# Altium project ZYNQ_Industrial_Data_Acquisition.PrjPcb (part 2 of 2)

## Sheet 10_FE_LANPORT.SchDoc
size A4; SheetNumber: 11; SheetTotal: 11
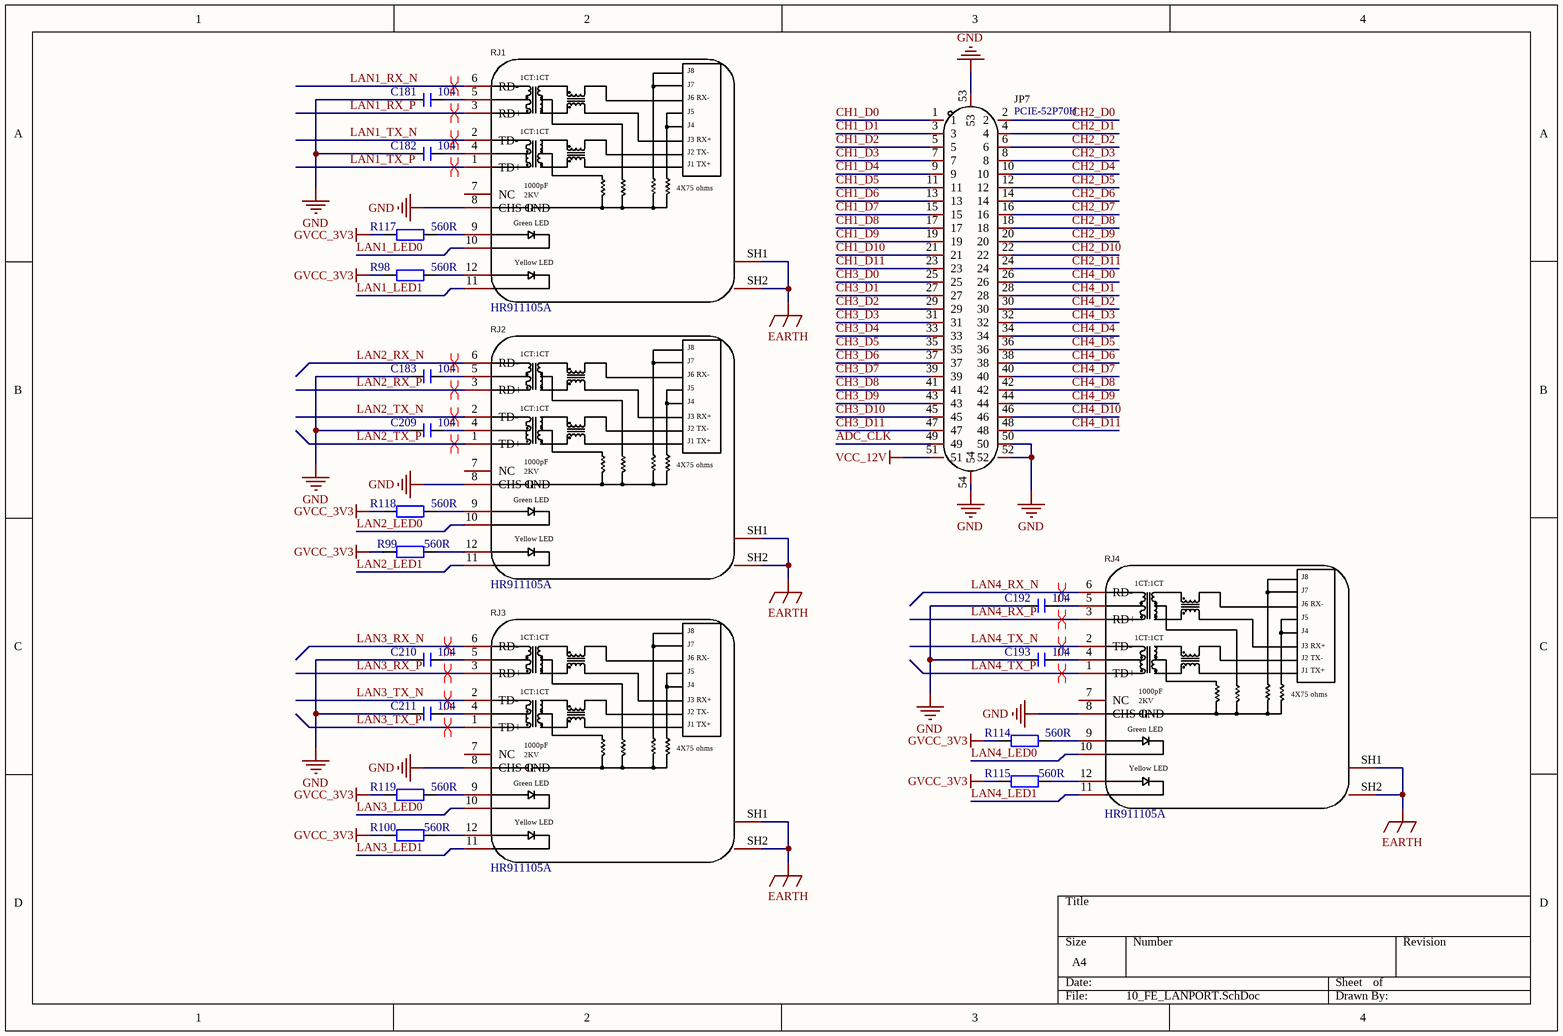
[diagram p9: 10_FE_LANPORT.SchDoc]

### Parts
C181  104  [C 0603]
C182  104  [C 0603]
C183  104  [C 0603]
C192  104  [C 0603]
C193  104  [C 0603]
C209  104  [C 0603]
C210  104  [C 0603]
C211  104  [C 0603]
JP7  PCIE-52P70H  [MINI PCIe]
R98  560R  [R 0603]
R99  560R  [R 0603]
R100  560R  [R 0603]
R114  560R  [R 0603]
R115  560R  [R 0603]
R117  560R  [R 0603]
R118  560R  [R 0603]
R119  560R  [R 0603]
RJ1  HR911105A  [HR91105A]
RJ2  HR911105A  [HR91105A]
RJ3  HR911105A  [HR91105A]
RJ4  HR911105A  [HR91105A]

### Nets
EARTH: RJ1.SH1 RJ1.SH2 RJ2.SH1 RJ2.SH2 RJ3.SH1 RJ3.SH2 RJ4.SH1 RJ4.SH2
GND: C181.1 C182.2 C183.2 C192.1 C193.1 C209.1 C210.1 C211.1 JP7.50 JP7.52 JP7.53 JP7.54 RJ1.8(CHS_GND) RJ2.8(CHS_GND) RJ3.8(CHS_GND) RJ4.8(CHS_GND)
GVCC_3V3: R98.2 R99.1 R100.1 R114.2 R115.1 R117.2 R118.2 R119.2
VCC_12V: JP7.51
ADC_CLK: JP7.49
CH1_D0: JP7.1
CH1_D1: JP7.3
CH1_D2: JP7.5
CH1_D3: JP7.7
CH1_D4: JP7.9
CH1_D5: JP7.11
CH1_D6: JP7.13
CH1_D7: JP7.15
CH1_D8: JP7.17
CH1_D9: JP7.19
CH1_D10: JP7.21
CH1_D11: JP7.23
CH2_D0: JP7.2
CH2_D1: JP7.4
CH2_D2: JP7.6
CH2_D3: JP7.8
CH2_D4: JP7.10
CH2_D5: JP7.12
CH2_D6: JP7.14
CH2_D7: JP7.16
CH2_D8: JP7.18
CH2_D9: JP7.20
CH2_D10: JP7.22
CH2_D11: JP7.24
CH3_D0: JP7.25
CH3_D1: JP7.27
CH3_D2: JP7.29
CH3_D3: JP7.31
CH3_D4: JP7.33
CH3_D5: JP7.35
CH3_D6: JP7.37
CH3_D7: JP7.39
CH3_D8: JP7.41
CH3_D9: JP7.43
CH3_D10: JP7.45
CH3_D11: JP7.47
CH4_D0: JP7.26
CH4_D1: JP7.28
CH4_D2: JP7.30
CH4_D3: JP7.32
CH4_D4: JP7.34
CH4_D5: JP7.36
CH4_D6: JP7.38
CH4_D7: JP7.40
CH4_D8: JP7.42
CH4_D9: JP7.44
CH4_D10: JP7.46
CH4_D11: JP7.48
LAN1_LED0: RJ1.10
LAN1_LED1: RJ1.11
LAN1_RX_N: RJ1.6(RD-)
LAN1_RX_P: RJ1.3(RD+)
LAN1_TX_N: RJ1.2(TD-)
LAN1_TX_P: RJ1.1(TD+)
LAN2_LED0: RJ2.10
LAN2_LED1: RJ2.11
LAN2_RX_N: RJ2.6(RD-)
LAN2_RX_P: RJ2.3(RD+)
LAN2_TX_N: RJ2.2(TD-)
LAN2_TX_P: RJ2.1(TD+)
LAN3_LED0: RJ3.10
LAN3_LED1: RJ3.11
LAN3_RX_N: RJ3.6(RD-)
LAN3_RX_P: RJ3.3(RD+)
LAN3_TX_N: RJ3.2(TD-)
LAN3_TX_P: RJ3.1(TD+)
LAN4_LED0: RJ4.10
LAN4_LED1: RJ4.11
LAN4_RX_N: RJ4.6(RD-)
LAN4_RX_P: RJ4.3(RD+)
LAN4_TX_N: RJ4.2(TD-)
LAN4_TX_P: RJ4.1(TD+)
NetC181_2: C181.2 RJ1.5
NetC182_1: C182.1 RJ1.4
NetC183_1: C183.1 RJ2.5
NetC192_2: C192.2 RJ4.5
NetC193_2: C193.2 RJ4.4
NetC209_2: C209.2 RJ2.4
NetC210_2: C210.2 RJ3.5
NetC211_2: C211.2 RJ3.4
NetR98_1: R98.1 RJ1.12
NetR99_2: R99.2 RJ2.12
NetR100_2: R100.2 RJ3.12
NetR114_1: R114.1 RJ4.9
NetR115_2: R115.2 RJ4.12
NetR117_1: R117.1 RJ1.9
NetR118_1: R118.1 RJ2.9
NetR119_1: R119.1 RJ3.9

Not connected (* = marked no-connect by the designer): RJ1 7(NC); RJ2 7(NC); RJ3 7(NC); RJ4 7(NC)

### Layout directives
differential pair: LAN1_RX_N, LAN1_RX_P, LAN1_TX_N, LAN1_TX_P, LAN2_RX_N, LAN2_RX_P, LAN2_TX_N, LAN2_TX_P, LAN3_RX_N, LAN3_RX_P, LAN3_TX_N, LAN3_TX_P, LAN4_RX_N, LAN4_RX_P, LAN4_TX_N, LAN4_TX_P

### Notes on the sheet
- (in symbol HR911105A) J8; 1CT:1CT; J7; J6 RX-; J5; J4; J3 RX+; J2 TX-; J1 TX+; 1000pF; 4X75 ohms; 2KV; Green LED; Yellow LED

### Library data of the parts
C181-C183 C192 C193 C209-C211 = C: 无极性贴片电容; 版权归属: 源创客; BOM名称: 无极性贴片电容; 学习资源: www.ooocke.com
JP7 = PCIE-52P70H: Manufacturer: XUNPU(讯普); Symbol: PCIE-52P70H_C2982554; Add into BOM: yes; Name: PCIE-52P70H; Device: PCIE-52P70H; LCSC Part Name: PCIE-52P70H; Supplier Part: C2982554; Manufacturer Part: PCIE-52P70H; Supplier Footprint: SMD,P=0.8mm; JLCPCB Part Class: Extended Part; Datasheet: https://atta.szlcsc.com/upload/public/pdf/source/20220311/DC8B167F9A8E29C645B8AA97E9059897.pdf; Supplier: LCSC; Convert to PCB: yes
R98-R100 R114 R115 R117-R119 = R: 贴片电阻; 版权归属: 源创客; BOM名称: 贴片电阻; 学习资源: www.ooocke.com
RJ1-RJ4 = HR911105A: Manufacturer: HANRUN(汉仁); Symbol: HR911105A_C12074; Add into BOM: yes; Connector Type: RJ插座; USOC Codes: RJ45; Number of Ports: 1; LED: 带LED; Name: HR911105A; Device: HR911105A_C12074; LCSC Part Name: RJ45 带LED 带LED灯; Supplier Part: C12074; Manufacturer Part: HR911105A; Supplier Footprint: 插件; JLCPCB Part Class: Extended Part; Datasheet: https://atta.szlcsc.com/upload/public/pdf/source/20170918/C12074_1505726819496976146.pdf; Supplier: LCSC; Convert to PCB: yes; Ratings: -; Shielding: -

## Nets that join several sheets
DDR_VREF: 01_DDR3L_256Mx32bits (8 pins), 02_ZYNQ_POWER (C38.2 C39.2 U1.H7 U1.P7), 03_SYS_POWER (C155.1 C156.1 U9.6), 09_TFCARD&USB2.0 (TP9.1)
DDR_VTT: 01_DDR3L_256Mx32bits (35 pins), 03_SYS_POWER (C151.1 C152.1 U9.3 U9.5), 09_TFCARD&USB2.0 (TP8.1)
EARTH: 03_SYS_POWER (JP2.1), 06_CAN&RS485 (13 pins), 08_HDMI (HDMI1.G1 HDMI1.G2 HDMI1.G3 HDMI1.G4), 10_FE_LANPORT (8 pins)
GND: 01_DDR3L_256Mx32bits (81 pins), 02_ZYNQ_POWER (129 pins), 03_SYS_POWER (63 pins), 04_ZYNQ_BANK13_33_34 (13 pins), 05_ZYNQ_BANK0_1_34_35 (14 pins), 06_CAN&RS485 (13 pins), 07_FE_SWITCHING (28 pins), 08_HDMI (17 pins), 09_TFCARD&USB2.0 (26 pins), 10_FE_LANPORT (16 pins)
GVCC_1V8: 03_SYS_POWER (C157.2 C158.2 U10.2), 07_FE_SWITCHING (7 pins), 09_TFCARD&USB2.0 (12 pins)
GVCC_3V3: 03_SYS_POWER (C139.2 C140.1 L8.2 R60.2), 04_ZYNQ_BANK13_33_34 (R84.1 R85.1), 05_ZYNQ_BANK0_1_34_35 (R121.1 R122.1 VD1.2), 06_CAN&RS485 (6 pins), 07_FE_SWITCHING (C200.2 L13.2 U16.3), 08_HDMI (C191.1 Q4.2), 09_TFCARD&USB2.0 (14 pins), 10_FE_LANPORT (8 pins)
VCC_1V0: 02_ZYNQ_POWER (30 pins), 03_SYS_POWER (5 pins), 09_TFCARD&USB2.0 (TP1.1)
VCC_1V8: 02_ZYNQ_POWER (23 pins), 03_SYS_POWER (7 pins), 04_ZYNQ_BANK13_33_34 (L3.1 U1.G9), 05_ZYNQ_BANK0_1_34_35 (R37.2 R108.1), 09_TFCARD&USB2.0 (TP4.1)
VCC_1V35: 01_DDR3L_256Mx32bits (61 pins), 02_ZYNQ_POWER (15 pins), 03_SYS_POWER (9 pins), 09_TFCARD&USB2.0 (TP3.1)
VCC_3V3: 02_ZYNQ_POWER (61 pins), 03_SYS_POWER (13 pins), 04_ZYNQ_BANK13_33_34 (9 pins), 05_ZYNQ_BANK0_1_34_35 (9 pins), 09_TFCARD&USB2.0 (TP5.1)
VCC_5V0: 03_SYS_POWER (28 pins), 06_CAN&RS485 (C162.2 C163.2 U11.8), 08_HDMI (D3.1 R124.2), 09_TFCARD&USB2.0 (5 pins)
VCC_12V: 03_SYS_POWER (5 pins), 10_FE_LANPORT (JP7.51)
ADC_CLK: 04_ZYNQ_BANK13_33_34 (U1.W18), 10_FE_LANPORT (JP7.49)
AXI_I2C1_SCL: 04_ZYNQ_BANK13_33_34 (U1.AB22), 05_ZYNQ_BANK0_1_34_35 (R121.2 U15.6)
AXI_I2C1_SDA: 04_ZYNQ_BANK13_33_34 (U1.AB21), 05_ZYNQ_BANK0_1_34_35 (R122.2 U15.5)
AXI_I2C2_SCL: 05_ZYNQ_BANK0_1_34_35 (U1.H22), 08_HDMI (Q1.2 R76.1)
AXI_I2C2_SDA: 05_ZYNQ_BANK0_1_34_35 (U1.J21), 08_HDMI (Q2.2 R80.1)
AXI_UART1_DE: 05_ZYNQ_BANK0_1_34_35 (U1.B20), 06_CAN&RS485 (U12.4 U12.5)
AXI_UART1_RX: 05_ZYNQ_BANK0_1_34_35 (U1.A21), 06_CAN&RS485 (U12.6)
AXI_UART1_TX: 05_ZYNQ_BANK0_1_34_35 (U1.B19), 06_CAN&RS485 (U12.3)
BOOT_MODE0: 01_DDR3L_256Mx32bits (U1.E4), 04_ZYNQ_BANK13_33_34 (R112.1)
BOOT_MODE1: 01_DDR3L_256Mx32bits (U1.A3), 04_ZYNQ_BANK13_33_34 (R111.1)
CAN0_RX: 01_DDR3L_256Mx32bits (U1.G7), 06_CAN&RS485 (U11.4)
CAN0_TX: 01_DDR3L_256Mx32bits (U1.B4), 06_CAN&RS485 (U11.5)
CH1_D0: 04_ZYNQ_BANK13_33_34 (U1.AA16), 10_FE_LANPORT (JP7.1)
CH1_D1: 04_ZYNQ_BANK13_33_34 (U1.AB17), 10_FE_LANPORT (JP7.3)
CH1_D2: 04_ZYNQ_BANK13_33_34 (U1.AA17), 10_FE_LANPORT (JP7.5)
CH1_D3: 04_ZYNQ_BANK13_33_34 (U1.AB19), 10_FE_LANPORT (JP7.7)
CH1_D4: 04_ZYNQ_BANK13_33_34 (U1.AA19), 10_FE_LANPORT (JP7.9)
CH1_D5: 04_ZYNQ_BANK13_33_34 (U1.Y19), 10_FE_LANPORT (JP7.11)
CH1_D6: 04_ZYNQ_BANK13_33_34 (U1.AB20), 10_FE_LANPORT (JP7.13)
CH1_D7: 04_ZYNQ_BANK13_33_34 (U1.Y20), 10_FE_LANPORT (JP7.15)
CH1_D8: 04_ZYNQ_BANK13_33_34 (U1.AA21), 10_FE_LANPORT (JP7.17)
CH1_D9: 04_ZYNQ_BANK13_33_34 (U1.Y21), 10_FE_LANPORT (JP7.19)
CH1_D10: 04_ZYNQ_BANK13_33_34 (U1.W20), 10_FE_LANPORT (JP7.21)
CH1_D11: 04_ZYNQ_BANK13_33_34 (U1.AA22), 10_FE_LANPORT (JP7.23)
CH2_D0: 04_ZYNQ_BANK13_33_34 (U1.V20), 10_FE_LANPORT (JP7.2)
CH2_D1: 04_ZYNQ_BANK13_33_34 (U1.W21), 10_FE_LANPORT (JP7.4)
CH2_D2: 04_ZYNQ_BANK13_33_34 (U1.W22), 10_FE_LANPORT (JP7.6)
CH2_D3: 04_ZYNQ_BANK13_33_34 (U1.U20), 10_FE_LANPORT (JP7.8)
CH2_D4: 05_ZYNQ_BANK0_1_34_35 (U1.T19), 10_FE_LANPORT (JP7.10)
CH2_D5: 04_ZYNQ_BANK13_33_34 (U1.U22), 10_FE_LANPORT (JP7.12)
CH2_D6: 04_ZYNQ_BANK13_33_34 (U1.T21), 10_FE_LANPORT (JP7.14)
CH2_D7: 05_ZYNQ_BANK0_1_34_35 (U1.R20), 10_FE_LANPORT (JP7.16)
CH2_D8: 05_ZYNQ_BANK0_1_34_35 (U1.R21), 10_FE_LANPORT (JP7.18)
CH2_D9: 05_ZYNQ_BANK0_1_34_35 (U1.P21), 10_FE_LANPORT (JP7.20)
CH2_D10: 05_ZYNQ_BANK0_1_34_35 (U1.P22), 10_FE_LANPORT (JP7.22)
CH2_D11: 05_ZYNQ_BANK0_1_34_35 (U1.P20), 10_FE_LANPORT (JP7.24)
CH3_D0: 04_ZYNQ_BANK13_33_34 (U1.AB10), 10_FE_LANPORT (JP7.25)
CH3_D1: 04_ZYNQ_BANK13_33_34 (U1.AA11), 10_FE_LANPORT (JP7.27)
CH3_D2: 04_ZYNQ_BANK13_33_34 (U1.AB11), 10_FE_LANPORT (JP7.29)
CH3_D3: 04_ZYNQ_BANK13_33_34 (U1.AA12), 10_FE_LANPORT (JP7.31)
CH3_D4: 04_ZYNQ_BANK13_33_34 (U1.AB12), 10_FE_LANPORT (JP7.33)
CH3_D5: 04_ZYNQ_BANK13_33_34 (U1.AB14), 10_FE_LANPORT (JP7.35)
CH3_D6: 04_ZYNQ_BANK13_33_34 (U1.Y14), 10_FE_LANPORT (JP7.37)
CH3_D7: 04_ZYNQ_BANK13_33_34 (U1.AA14), 10_FE_LANPORT (JP7.39)
CH3_D8: 04_ZYNQ_BANK13_33_34 (U1.Y18), 10_FE_LANPORT (JP7.41)
CH3_D9: 04_ZYNQ_BANK13_33_34 (U1.W16), 10_FE_LANPORT (JP7.43)
CH3_D10: 04_ZYNQ_BANK13_33_34 (U1.V18), 10_FE_LANPORT (JP7.45)
CH3_D11: 04_ZYNQ_BANK13_33_34 (U1.V22), 10_FE_LANPORT (JP7.47)
CH4_D0: 05_ZYNQ_BANK0_1_34_35 (U1.M20), 10_FE_LANPORT (JP7.26)
CH4_D1: 05_ZYNQ_BANK0_1_34_35 (U1.N22), 10_FE_LANPORT (JP7.28)
CH4_D2: 05_ZYNQ_BANK0_1_34_35 (U1.M22), 10_FE_LANPORT (JP7.30)
CH4_D3: 05_ZYNQ_BANK0_1_34_35 (U1.M21), 10_FE_LANPORT (JP7.32)
CH4_D4: 05_ZYNQ_BANK0_1_34_35 (U1.M19), 10_FE_LANPORT (JP7.34)
CH4_D5: 05_ZYNQ_BANK0_1_34_35 (U1.L22), 10_FE_LANPORT (JP7.36)
CH4_D6: 05_ZYNQ_BANK0_1_34_35 (U1.L19), 10_FE_LANPORT (JP7.38)
CH4_D7: 05_ZYNQ_BANK0_1_34_35 (U1.L21), 10_FE_LANPORT (JP7.40)
CH4_D8: 05_ZYNQ_BANK0_1_34_35 (U1.K20), 10_FE_LANPORT (JP7.42)
CH4_D9: 05_ZYNQ_BANK0_1_34_35 (U1.K21), 10_FE_LANPORT (JP7.44)
CH4_D10: 05_ZYNQ_BANK0_1_34_35 (U1.J18), 10_FE_LANPORT (JP7.46)
CH4_D11: 05_ZYNQ_BANK0_1_34_35 (U1.J20), 10_FE_LANPORT (JP7.48)
ETH0_RXCLK: 05_ZYNQ_BANK0_1_34_35 (U1.A14), 07_FE_SWITCHING (U5.44)
ETH0_RXCTL: 05_ZYNQ_BANK0_1_34_35 (U1.D7), 07_FE_SWITCHING (U5.51)
ETH0_RXD0: 05_ZYNQ_BANK0_1_34_35 (U1.E11), 07_FE_SWITCHING (U5.45)
ETH0_RXD1: 05_ZYNQ_BANK0_1_34_35 (U1.B7), 07_FE_SWITCHING (U5.46)
ETH0_RXD2: 05_ZYNQ_BANK0_1_34_35 (U1.F12), 07_FE_SWITCHING (U5.49)
ETH0_RXD3: 05_ZYNQ_BANK0_1_34_35 (U1.A13), 07_FE_SWITCHING (U5.50)
ETH0_TXCLK: 05_ZYNQ_BANK0_1_34_35 (U1.D6), 07_FE_SWITCHING (U5.43)
ETH0_TXCTL: 05_ZYNQ_BANK0_1_34_35 (U1.F11), 07_FE_SWITCHING (U5.29)
ETH0_TXD0: 05_ZYNQ_BANK0_1_34_35 (U1.E9), 07_FE_SWITCHING (U5.30)
ETH0_TXD1: 05_ZYNQ_BANK0_1_34_35 (U1.A7), 07_FE_SWITCHING (U5.32)
ETH0_TXD2: 05_ZYNQ_BANK0_1_34_35 (U1.E10), 07_FE_SWITCHING (U5.35)
ETH0_TXD3: 05_ZYNQ_BANK0_1_34_35 (U1.A8), 07_FE_SWITCHING (U5.36)
HDMI_CK_N: 05_ZYNQ_BANK0_1_34_35 (U1.G21), 08_HDMI (D2.5 D2.6 HDMI1.12 R73.1)
HDMI_CK_P: 05_ZYNQ_BANK0_1_34_35 (U1.G20), 08_HDMI (D2.4 D2.7 HDMI1.10 R72.1)
HDMI_D0_N: 05_ZYNQ_BANK0_1_34_35 (U1.D21), 08_HDMI (D2.2 D2.9 HDMI1.9 R71.1)
HDMI_D0_P: 05_ZYNQ_BANK0_1_34_35 (U1.E21), 08_HDMI (D2.1 D2.10 HDMI1.7 R70.1)
HDMI_D1_N: 05_ZYNQ_BANK0_1_34_35 (U1.B22), 08_HDMI (D1.5 D1.6 HDMI1.6 R69.1)
HDMI_D1_P: 05_ZYNQ_BANK0_1_34_35 (U1.B21), 08_HDMI (D1.4 D1.7 HDMI1.4 R68.1)
HDMI_D2_N: 05_ZYNQ_BANK0_1_34_35 (U1.A19), 08_HDMI (D1.2 D1.9 HDMI1.3 R67.1)
HDMI_D2_P: 05_ZYNQ_BANK0_1_34_35 (U1.A18), 08_HDMI (D1.1 D1.10 HDMI1.1 R66.1)
HDMI_HPD: 05_ZYNQ_BANK0_1_34_35 (U1.J22), 08_HDMI (R90.1 R91.2)
LAN1_LED0: 07_FE_SWITCHING (U5.65), 10_FE_LANPORT (RJ1.10)
LAN1_LED1: 07_FE_SWITCHING (U5.64), 10_FE_LANPORT (RJ1.11)
LAN1_RX_N: 07_FE_SWITCHING (U5.5), 10_FE_LANPORT (RJ1.6)
LAN1_RX_P: 07_FE_SWITCHING (U5.4), 10_FE_LANPORT (RJ1.3)
LAN1_TX_N: 07_FE_SWITCHING (U5.7), 10_FE_LANPORT (RJ1.2)
LAN1_TX_P: 07_FE_SWITCHING (U5.6), 10_FE_LANPORT (RJ1.1)
LAN2_LED0: 07_FE_SWITCHING (R116.2 U5.63), 10_FE_LANPORT (RJ2.10)
LAN2_LED1: 07_FE_SWITCHING (U5.62), 10_FE_LANPORT (RJ2.11)
LAN2_RX_N: 07_FE_SWITCHING (U5.9), 10_FE_LANPORT (RJ2.6)
LAN2_RX_P: 07_FE_SWITCHING (U5.8), 10_FE_LANPORT (RJ2.3)
LAN2_TX_N: 07_FE_SWITCHING (U5.11), 10_FE_LANPORT (RJ2.2)
LAN2_TX_P: 07_FE_SWITCHING (U5.10), 10_FE_LANPORT (RJ2.1)
LAN3_LED0: 07_FE_SWITCHING (U5.25), 10_FE_LANPORT (RJ3.10)
LAN3_LED1: 07_FE_SWITCHING (U5.24), 10_FE_LANPORT (RJ3.11)
LAN3_RX_N: 07_FE_SWITCHING (U5.14), 10_FE_LANPORT (RJ3.6)
LAN3_RX_P: 07_FE_SWITCHING (U5.13), 10_FE_LANPORT (RJ3.3)
LAN3_TX_N: 07_FE_SWITCHING (U5.16), 10_FE_LANPORT (RJ3.2)
LAN3_TX_P: 07_FE_SWITCHING (U5.15), 10_FE_LANPORT (RJ3.1)
LAN4_LED0: 07_FE_SWITCHING (U5.31), 10_FE_LANPORT (RJ4.10)
LAN4_LED1: 07_FE_SWITCHING (U5.28), 10_FE_LANPORT (RJ4.11)
LAN4_RX_N: 07_FE_SWITCHING (U5.18), 10_FE_LANPORT (RJ4.6)
LAN4_RX_P: 07_FE_SWITCHING (U5.17), 10_FE_LANPORT (RJ4.3)
LAN4_TX_N: 07_FE_SWITCHING (U5.20), 10_FE_LANPORT (RJ4.2)
LAN4_TX_P: 07_FE_SWITCHING (U5.19), 10_FE_LANPORT (RJ4.1)
PL_CLK: 04_ZYNQ_BANK13_33_34 (U1.U21), 05_ZYNQ_BANK0_1_34_35 (R81.2)
PS_LED: 01_DDR3L_256Mx32bits (U1.A1), 04_ZYNQ_BANK13_33_34 (D12.2)
PS_MIO2: 01_DDR3L_256Mx32bits (U1.A2), 04_ZYNQ_BANK13_33_34 (R34.2)
PS_MIO3: 01_DDR3L_256Mx32bits (U1.F6), 04_ZYNQ_BANK13_33_34 (R51.2)
PS_MIO6: 01_DDR3L_256Mx32bits (U1.A4), 04_ZYNQ_BANK13_33_34 (R31.2)
PS_MIO7: 01_DDR3L_256Mx32bits (U1.D5), 04_ZYNQ_BANK13_33_34 (R32.2)
PS_MIO8: 01_DDR3L_256Mx32bits (U1.E5), 04_ZYNQ_BANK13_33_34 (R33.2)
PS_UART0_RX: 04_ZYNQ_BANK13_33_34 (TP10.1), 05_ZYNQ_BANK0_1_34_35 (U1.B6)
PS_UART0_TX: 04_ZYNQ_BANK13_33_34 (TP11.1), 05_ZYNQ_BANK0_1_34_35 (U1.E6)
SD_CD: 01_DDR3L_256Mx32bits (U1.A6), 09_TFCARD&USB2.0 (R130.1 TF_CARD1.9)
SD_CLK: 05_ZYNQ_BANK0_1_34_35 (U1.E13), 09_TFCARD&USB2.0 (R52.1)
SD_CMD: 01_DDR3L_256Mx32bits (U1.C8), 09_TFCARD&USB2.0 (U6.4)
SD_D0: 05_ZYNQ_BANK0_1_34_35 (U1.E14), 09_TFCARD&USB2.0 (U6.6)
SD_D1: 01_DDR3L_256Mx32bits (U1.B11), 09_TFCARD&USB2.0 (U6.7)
SD_D2: 05_ZYNQ_BANK0_1_34_35 (U1.D8), 09_TFCARD&USB2.0 (U6.1)
SD_D3: 01_DDR3L_256Mx32bits (U1.B9), 09_TFCARD&USB2.0 (U6.3)
SPI1_CLK: 05_ZYNQ_BANK0_1_34_35 (U1.D11), 07_FE_SWITCHING (U5.67)
SPI1_CS: 05_ZYNQ_BANK0_1_34_35 (U1.D13), 07_FE_SWITCHING (U5.69)
SPI1_MISO: 01_DDR3L_256Mx32bits (U1.B10), 07_FE_SWITCHING (U5.66)
SPI1_MOSI: 05_ZYNQ_BANK0_1_34_35 (U1.D12), 07_FE_SWITCHING (U5.68)
USB_CLK: 05_ZYNQ_BANK0_1_34_35 (U1.A9), 09_TFCARD&USB2.0 (R62.2)
USB_D0: 05_ZYNQ_BANK0_1_34_35 (U1.C7), 09_TFCARD&USB2.0 (U8.3)
USB_D1: 05_ZYNQ_BANK0_1_34_35 (U1.G13), 09_TFCARD&USB2.0 (U8.4)
USB_D2: 05_ZYNQ_BANK0_1_34_35 (U1.B12), 09_TFCARD&USB2.0 (U8.5)
USB_D3: 05_ZYNQ_BANK0_1_34_35 (U1.F14), 09_TFCARD&USB2.0 (U8.6)
USB_D4: 05_ZYNQ_BANK0_1_34_35 (U1.A12), 09_TFCARD&USB2.0 (U8.7)
USB_D5: 01_DDR3L_256Mx32bits (U1.B14), 09_TFCARD&USB2.0 (U8.9)
USB_D6: 05_ZYNQ_BANK0_1_34_35 (U1.F13), 09_TFCARD&USB2.0 (U8.10)
USB_D7: 01_DDR3L_256Mx32bits (U1.C13), 09_TFCARD&USB2.0 (U8.13)
USB_DIR: 05_ZYNQ_BANK0_1_34_35 (U1.E8), 09_TFCARD&USB2.0 (U8.31)
USB_NXT: 05_ZYNQ_BANK0_1_34_35 (U1.F9), 09_TFCARD&USB2.0 (U8.2)
USB_STP: 05_ZYNQ_BANK0_1_34_35 (U1.A11), 09_TFCARD&USB2.0 (U8.29)